# EAGLE design e-wall-smd (EAGLE 6.5.0)
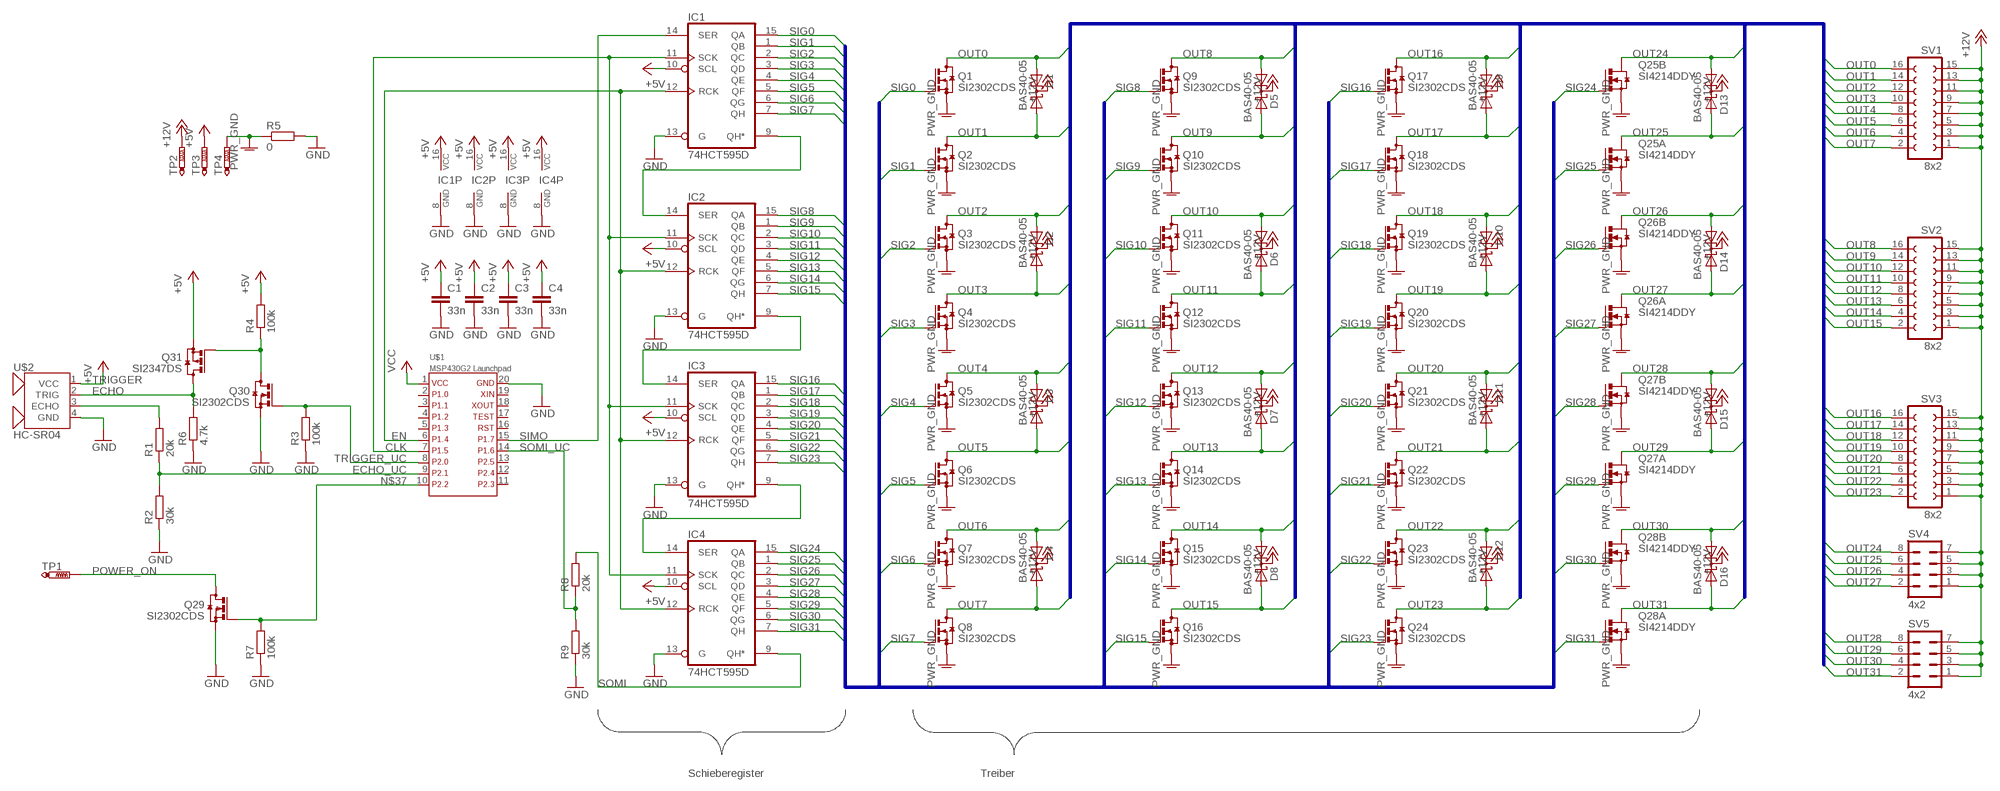
[diagram p0: schematic, sheet 1]

## Parts
C1  33n  C-EUC1206  [C1206]
C2  33n  C-EUC1206  [C1206]
C3  33n  C-EUC1206  [C1206]
C4  33n  C-EUC1206  [C1206]
D1  BAS40-05  [SOT23]
D2  BAS40-05  [SOT23]
D3  BAS40-05  [SOT23]
D4  BAS40-05  [SOT23]
D5  BAS40-05  [SOT23]
D6  BAS40-05  [SOT23]
D7  BAS40-05  [SOT23]
D8  BAS40-05  [SOT23]
D9  BAS40-05  [SOT23]
D10  BAS40-05  [SOT23]
D11  BAS40-05  [SOT23]
D12  BAS40-05  [SOT23]
D13  BAS40-05  [SOT23]
D14  BAS40-05  [SOT23]
D15  BAS40-05  [SOT23]
D16  BAS40-05  [SOT23]
IC1  74HCT595D  [SO16]
IC2  74HCT595D  [SO16]
IC3  74HCT595D  [SO16]
IC4  74HCT595D  [SO16]
Q1  SI2302CDS  BSS123  [SOT23]
Q2  SI2302CDS  BSS123  [SOT23]
Q3  SI2302CDS  BSS123  [SOT23]
Q4  SI2302CDS  BSS123  [SOT23]
Q5  SI2302CDS  BSS123  [SOT23]
Q6  SI2302CDS  BSS123  [SOT23]
Q7  SI2302CDS  BSS123  [SOT23]
Q8  SI2302CDS  BSS123  [SOT23]
Q9  SI2302CDS  BSS123  [SOT23]
Q10  SI2302CDS  BSS123  [SOT23]
Q11  SI2302CDS  BSS123  [SOT23]
Q12  SI2302CDS  BSS123  [SOT23]
Q13  SI2302CDS  BSS123  [SOT23]
Q14  SI2302CDS  BSS123  [SOT23]
Q15  SI2302CDS  BSS123  [SOT23]
Q16  SI2302CDS  BSS123  [SOT23]
Q17  SI2302CDS  BSS123  [SOT23]
Q18  SI2302CDS  BSS123  [SOT23]
Q19  SI2302CDS  BSS123  [SOT23]
Q20  SI2302CDS  BSS123  [SOT23]
Q21  SI2302CDS  BSS123  [SOT23]
Q22  SI2302CDS  BSS123  [SOT23]
Q23  SI2302CDS  BSS123  [SOT23]
Q24  SI2302CDS  BSS123  [SOT23]
Q25  SI4214DDY  IRF8313P  [SO-08]
Q26  SI4214DDY  IRF8313P  [SO-08]
Q27  SI4214DDY  IRF8313P  [SO-08]
Q28  SI4214DDY  IRF8313P  [SO-08]
Q29  SI2302CDS  BSS123  [SOT23]
Q30  SI2302CDS  BSS123  [SOT23]
Q31  SI2347DS  BSS84  [SOT23]
R1  20k  R-EU_R1206  [R1206]
R2  30k  R-EU_R1206  [R1206]
R3  100k  R-EU_R1206  [R1206]
R4  100k  R-EU_R1206  [R1206]
R5  0  R-EU_R1206  [R1206]
R6  4.7k  R-EU_R1206  [R1206]
R7  100k  R-EU_R1206  [R1206]
R8  20k  R-EU_R1206  [R1206]
R9  30k  R-EU_R1206  [R1206]
SV1  8x2  FE08-2  [FE08-2]
SV2  8x2  FE08-2  [FE08-2]
SV3  8x2  FE08-2  [FE08-2]
SV4  4x2  MA04-2  [MA04-2]
SV5  4x2  MA04-2  [MA04-2]
TP1  PTR1PAD1-20  [P1-20]
TP2  PTR1PAD1-20  [P1-20]
TP3  PTR1PAD1-20  [P1-20]
TP4  PTR1PAD1-20  [P1-20]
U$1  MSP430G2 Launchpad  MSP430LAUNCHPAD_BASIC  [MSP430LAUNCHPAD_BASIC]
U$2  HC-SR04  [HC-SR04]

## Nets
+5V [Power]: C1.1 C2.1 C3.1 C4.1 IC1.10(SCL) IC1.16(VCC) IC2.10(SCL) IC2.16(VCC) IC3.10(SCL) IC3.16(VCC) IC4.10(SCL) IC4.16(VCC) Q31.2(S) R4.2 TP3.TP U$2.1(VCC)
+12V [Power]: D1.3(C) D2.3(C) D3.3(C) D4.3(C) D5.3(C) D6.3(C) D7.3(C) D8.3(C) D9.3(C) D10.3(C) D11.3(C) D12.3(C) D13.3(C) D14.3(C) D15.3(C) D16.3(C) SV1.1 SV1.3 SV1.5 SV1.7 SV1.9 SV1.11 SV1.13 SV1.15 SV2.1 SV2.3 SV2.5 SV2.7 SV2.9 SV2.11 SV2.13 SV2.15 SV3.1 SV3.3 SV3.5 SV3.7 SV3.9 SV3.11 SV3.13 SV3.15 SV4.1 SV4.3 SV4.5 SV4.7 SV5.1 SV5.3 SV5.5 SV5.7 TP2.TP
CLK: IC1.11(SCK) IC2.11(SCK) IC3.11(SCK) IC4.11(SCK) U$1.7
ECHO: R1.2 U$2.3(ECHO)
ECHO_UC: R1.1 R2.2 U$1.9
EN: IC1.12(RCK) IC2.12(RCK) IC3.12(RCK) IC4.12(RCK) U$1.6
GND: C1.2 C2.2 C3.2 C4.2 IC1.8(GND) IC1.13(G) IC2.8(GND) IC2.13(G) IC3.8(GND) IC3.13(G) IC4.8(GND) IC4.13(G) Q29.2(S) Q30.2(S) R2.1 R3.1 R5.2 R6.1 R7.1 R9.1 U$1.20 U$2.4(GND)
N$1: IC1.9(QH*) IC2.14(SER)
N$2: IC2.9(QH*) IC3.14(SER)
N$3: IC3.9(QH*) IC4.14(SER)
N$34: Q30.3(D) Q31.1(G) R4.1
N$37: Q29.1(G) R7.2 U$1.10
OUT0: D1.2(A2) Q1.3(D) SV1.16
OUT1: D1.1(A1) Q2.3(D) SV1.14
OUT2: D2.2(A2) Q3.3(D) SV1.12
OUT3: D2.1(A1) Q4.3(D) SV1.10
OUT4: D3.2(A2) Q5.3(D) SV1.8
OUT5: D3.1(A1) Q6.3(D) SV1.6
OUT6: D4.2(A2) Q7.3(D) SV1.4
OUT7: D4.1(A1) Q8.3(D) SV1.2
OUT8: D5.1(A1) Q9.3(D) SV2.16
OUT9: D5.2(A2) Q10.3(D) SV2.14
OUT10: D6.1(A1) Q11.3(D) SV2.12
OUT11: D6.2(A2) Q12.3(D) SV2.10
OUT12: D7.1(A1) Q13.3(D) SV2.8
OUT13: D7.2(A2) Q14.3(D) SV2.6
OUT14: D8.1(A1) Q15.3(D) SV2.4
OUT15: D8.2(A2) Q16.3(D) SV2.2
OUT16: D9.2(A2) Q17.3(D) SV3.16
OUT17: D9.1(A1) Q18.3(D) SV3.14
OUT18: D10.2(A2) Q19.3(D) SV3.12
OUT19: D10.1(A1) Q20.3(D) SV3.10
OUT20: D11.2(A2) Q21.3(D) SV3.8
OUT21: D11.1(A1) Q22.3(D) SV3.6
OUT22: D12.2(A2) Q23.3(D) SV3.4
OUT23: D12.1(A1) Q24.3(D) SV3.2
OUT24: D13.1(A1) Q25.7(B:D) Q25.8(B:D) SV4.8
OUT25: D13.2(A2) Q25.5(A:D) Q25.6(A:D) SV4.6
OUT26: D14.1(A1) Q26.7(B:D) Q26.8(B:D) SV4.4
OUT27: D14.2(A2) Q26.5(A:D) Q26.6(A:D) SV4.2
OUT28: D15.1(A1) Q27.7(B:D) Q27.8(B:D) SV5.8
OUT29: D15.2(A2) Q27.5(A:D) Q27.6(A:D) SV5.6
OUT30: D16.1(A1) Q28.7(B:D) Q28.8(B:D) SV5.4
OUT31: D16.2(A2) Q28.5(A:D) Q28.6(A:D) SV5.2
POWER_ON: Q29.3(D) TP1.TP
PWR_GND: Q1.2(S) Q2.2(S) Q3.2(S) Q4.2(S) Q5.2(S) Q6.2(S) Q7.2(S) Q8.2(S) Q9.2(S) Q10.2(S) Q11.2(S) Q12.2(S) Q13.2(S) Q14.2(S) Q15.2(S) Q16.2(S) Q17.2(S) Q18.2(S) Q19.2(S) Q20.2(S) Q21.2(S) Q22.2(S) Q23.2(S) Q24.2(S) Q25.1(B:S) Q25.3(A:S) Q26.1(B:S) Q26.3(A:S) Q27.1(B:S) Q27.3(A:S) Q28.1(B:S) Q28.3(A:S) R5.1 TP4.TP
SIG0: IC1.15(QA) Q1.1(G)
SIG1: IC1.1(QB) Q2.1(G)
SIG2: IC1.2(QC) Q3.1(G)
SIG3: IC1.3(QD) Q4.1(G)
SIG4: IC1.4(QE) Q5.1(G)
SIG5: IC1.5(QF) Q6.1(G)
SIG6: IC1.6(QG) Q7.1(G)
SIG7: IC1.7(QH) Q8.1(G)
SIG8: IC2.15(QA) Q9.1(G)
SIG9: IC2.1(QB) Q10.1(G)
SIG10: IC2.2(QC) Q11.1(G)
SIG11: IC2.3(QD) Q12.1(G)
SIG12: IC2.4(QE) Q13.1(G)
SIG13: IC2.5(QF) Q14.1(G)
SIG14: IC2.6(QG) Q15.1(G)
SIG15: IC2.7(QH) Q16.1(G)
SIG16: IC3.15(QA) Q17.1(G)
SIG17: IC3.1(QB) Q18.1(G)
SIG18: IC3.2(QC) Q19.1(G)
SIG19: IC3.3(QD) Q20.1(G)
SIG20: IC3.4(QE) Q21.1(G)
SIG21: IC3.5(QF) Q22.1(G)
SIG22: IC3.6(QG) Q23.1(G)
SIG23: IC3.7(QH) Q24.1(G)
SIG24: IC4.15(QA) Q25.2(B:G)
SIG25: IC4.1(QB) Q25.4(A:G)
SIG26: IC4.2(QC) Q26.2(B:G)
SIG27: IC4.3(QD) Q26.4(A:G)
SIG28: IC4.4(QE) Q27.2(B:G)
SIG29: IC4.5(QF) Q27.4(A:G)
SIG30: IC4.6(QG) Q28.2(B:G)
SIG31: IC4.7(QH) Q28.4(A:G)
SIMO: IC1.14(SER) U$1.15
SOMI: IC4.9(QH*) R8.2
SOMI_UC: R8.1 R9.2 U$1.14
TRIGGER: Q31.3(D) R6.2 U$2.2(TRIG)
TRIGGER_UC: Q30.1(G) R3.2 U$1.8
VCC [Power]: U$1.1
Unconnected: U$1.2 U$1.3 U$1.4 U$1.5 U$1.11 U$1.12 U$1.13 U$1.16 U$1.17 U$1.18 U$1.19

## Buses
SIG[0..31]
OUT[0..31]

## Notes on the sheet
- Schieberegister | Treiber

## Library data of the parts
C1-C4 = resistor:C-EU: CAPACITOR, European symbol
D1-D16 = diode:BAS40-05: Silicon Schottky Diodes General-purpose diode for high-speed switching
IC1-IC4 = 74xx-eu:74*595: 8-bit SHIFT REGISTER, output latch
Q1-Q24 Q29 Q30 = transistor-small-signal:BSS123: N-CHANNEL MOS FET
Q25-Q28 = transistor-power:IRF8313P: HEXFET(R) Power MOSFET Source: Data sheet <http://www.irf.com/product-info/datasheets/data/irf8313pbf.pdf>
Q31 = transistor-small-signal:BSS84: P-CHANNEL MOS FET
R1-R9 = resistor:R-EU_: RESISTOR, European symbol
SV1-SV3 = con-lsta:FE08-2: FEMALE HEADER; OC_FARNELL: unknown; OC_NEWARK: unknown
SV4 SV5 = con-lstb:MA04-2: PIN HEADER; OC_FARNELL: unknown; OC_NEWARK: unknown
TP1-TP4 = testpad:PTR1: TEST PIN
U$1 = msp430launchpad:MSP430LAUNCHPAD_BASIC
U$2 = ultrasonic:HC-SR04

## Net classes
0 default: width 0.406 mm, clearance 0.15 mm
1 Power: width 0.61 mm, clearance 0.15 mm to class 0, clearance 0.15 mm

## Board
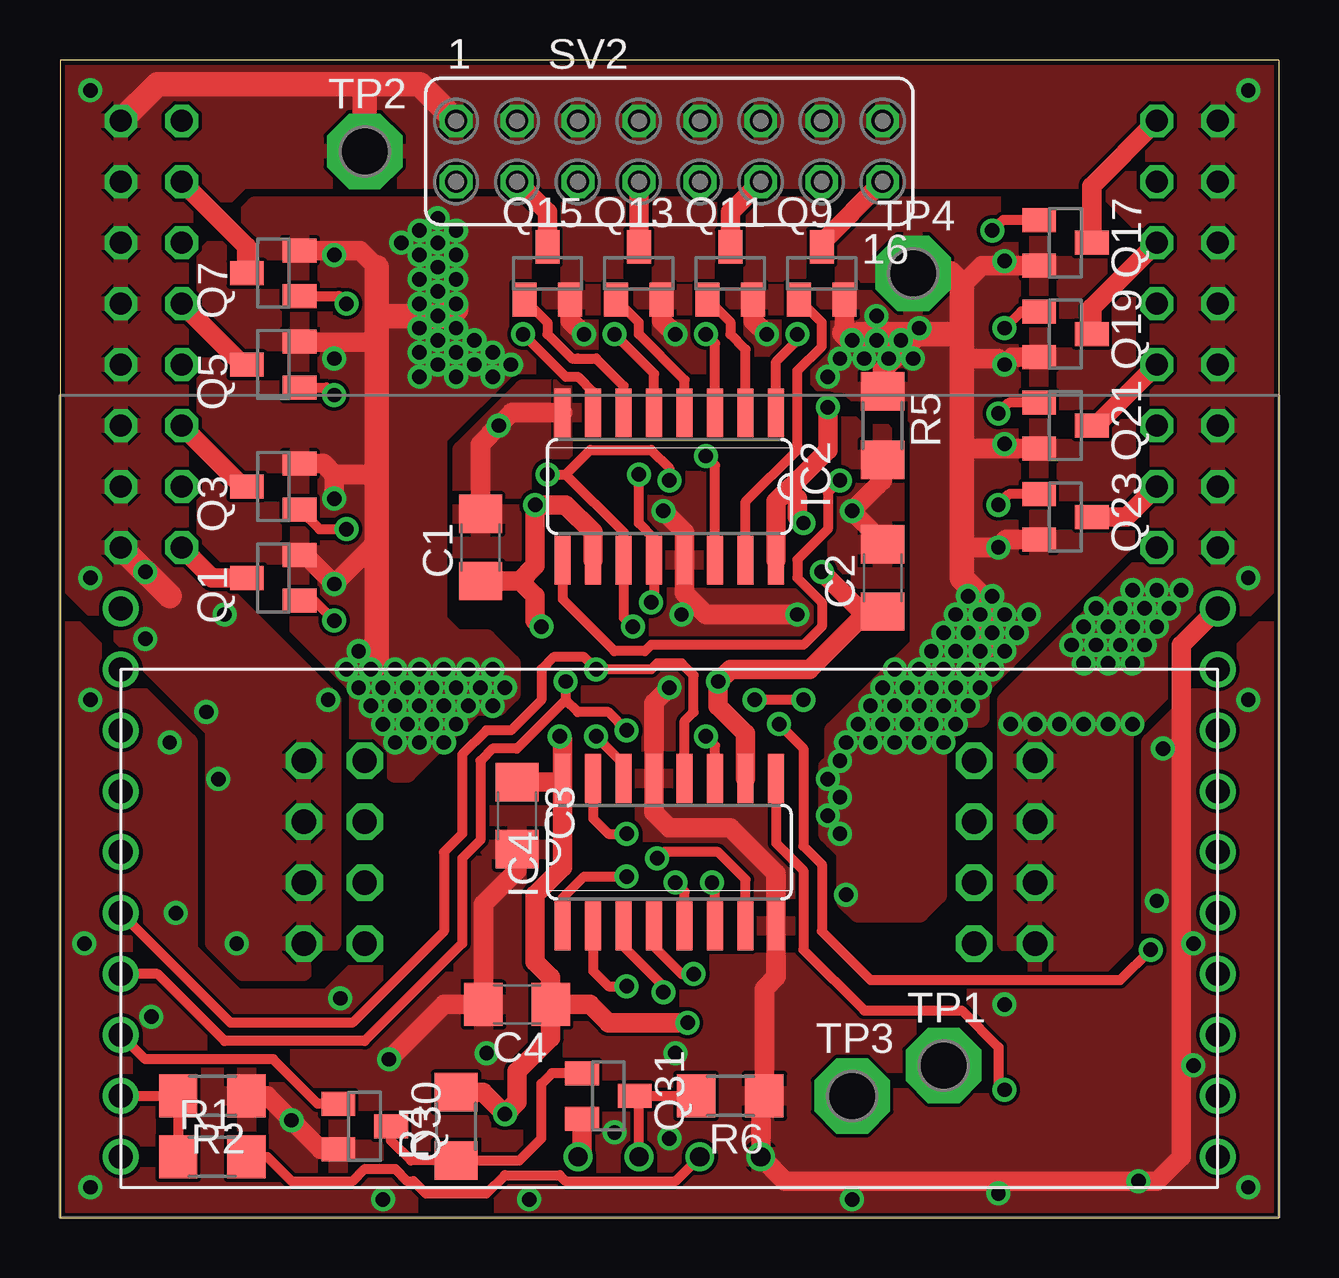
[diagram p1: board, top side]
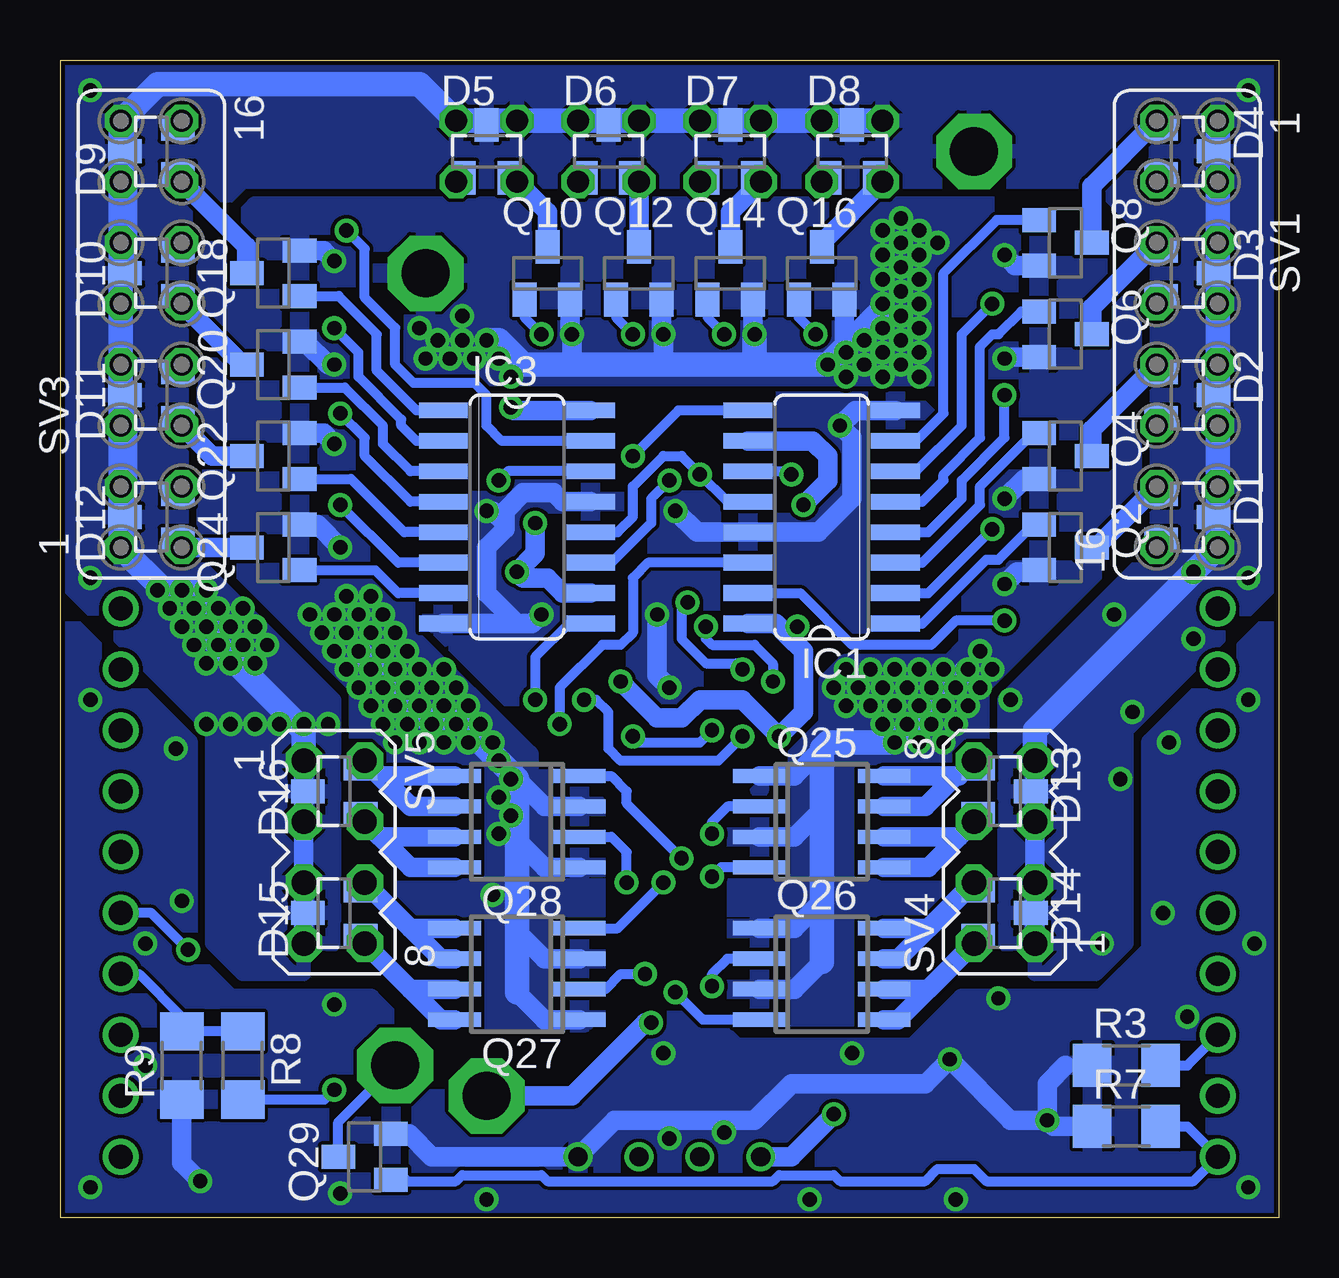
[diagram p2: board, bottom side, seen from below]

Size 50.8 x 48.26 mm. Coordinates in mm from the lower left corner, seen from the top.
Outline: 50.8,48.26 0,48.26 0,0 50.8,0 50.8,48.26
Copper layers (1*16): TOP 0.035mm / dielectric 1.5mm / Bottom 0.035mm
Design rules "platinensammler_03 *": minimum track width 0.15mm, minimum drill 0.3mm, track to track 0.15mm, track to pad 0.15mm, pad to pad 0.15mm, via to via 0.15mm, smd to smd 0mil, copper to edge 0.2mm, drill to drill 0.2mm, minimum pad ring 0.2mm, minimum via ring 0.2mm, stop-mask expansion 2mil, vias tented up to drill 0.8mm, thermal gap 0.15mm

### Footprints (pad centres in the part's own frame; a part is rotated, then mirrored left to right if it is on the bottom)
C1206 = smd 1.6 x 1.8: 1 -1.4,0; 2 1.4,0
SOT23 = smd 1 x 1.4: 1 -0.95,-1.1; 2 0.95,-1.1; 3 0,1.1
SO16 = smd 0.66 x 2.032: 1 -4.445,-3.073; 2 -3.175,-3.073; 3 -1.905,-3.073; 4 -0.635,-3.073; 5 0.635,-3.073; 6 1.905,-3.073; 7 3.175,-3.073; 8 4.445,-3.073; 9 4.445,3.073; 10 3.175,3.073; 11 1.905,3.073; 12 0.635,3.073; 13 -0.635,3.073; 14 -1.905,3.073; 15 -3.175,3.073; 16 -4.445,3.073
SO-08 = smd 0.6 x 2.2: 1 -1.905,-2.6; 2 -0.635,-2.6; 3 0.635,-2.6; 4 1.905,-2.6; 5 1.905,2.6; 6 0.635,2.6; 7 -0.635,2.6; 8 -1.905,2.6
R1206 = smd 1.6 x 1.803: 1 -1.422,0; 2 1.422,0
FE08-2 = drill 0.914 octagon: 1 -8.89,1.27; 2 -8.89,-1.27; 3 -6.35,1.27; 4 -6.35,-1.27; 5 -3.81,1.27; 6 -3.81,-1.27; 7 -1.27,1.27; 8 -1.27,-1.27; 9 1.27,1.27; 10 1.27,-1.27; 11 3.81,1.27; 12 3.81,-1.27; 13 6.35,1.27; 14 6.35,-1.27; 15 8.89,1.27; 16 8.89,-1.27
MA04-2 = drill 1.016 octagon: 1 -3.81,-1.27; 2 -3.81,1.27; 3 -1.27,-1.27; 4 -1.27,1.27; 5 1.27,-1.27; 6 1.27,1.27; 7 3.81,-1.27; 8 3.81,1.27
P1-20 = drill 2.007 pad 3.15 octagon: TP 0,0
MSP430LAUNCHPAD_BASIC = drill 1: 1 -22.86,11.43; 2 -22.86,8.89; 3 -22.86,6.35; 4 -22.86,3.81; 5 -22.86,1.27; 6 -22.86,-1.27; 7 -22.86,-3.81; 8 -22.86,-6.35; 9 -22.86,-8.89; 10 -22.86,-11.43; 11 22.86,-11.43; 12 22.86,-8.89; 13 22.86,-6.35; 14 22.86,-3.81; 15 22.86,-1.27; 16 22.86,1.27; 17 22.86,3.81; 18 22.86,6.35; 19 22.86,8.89; 20 22.86,11.43
HC-SR04 = drill 0.8: 1 -3.81,0; 2 -1.27,0; 3 1.27,0; 4 3.81,0

### Placement (x,y rotation side)
C1  17.53,27.94 90 top
C2  34.29,26.67 90 top
C3  19.05,16.76 270 top
C4  19.05,8.89 180 top
D1  3.81,29.21 270 bottom
D2  3.81,34.29 270 bottom
D3  3.81,39.37 270 bottom
D4  3.81,44.45 270 bottom
D5  33.02,44.45 0 bottom
D6  27.94,44.45 0 bottom
D7  22.86,44.45 0 bottom
D8  17.78,44.45 0 bottom
D9  46.99,44.45 90 bottom
D10  46.99,39.37 90 bottom
D11  46.99,34.29 90 bottom
D12  46.99,29.21 90 bottom
D13  11.43,17.78 270 bottom
D14  11.43,12.7 270 bottom
D15  39.37,12.7 90 bottom
D16  39.37,17.78 90 bottom
IC1  19.05,29.21 90 bottom
IC2  25.4,30.48 180 top
IC3  31.75,29.21 270 bottom
IC4  25.4,15.24 0 top
Q1  8.89,26.67 90 top
Q2  8.89,27.94 270 bottom
Q3  8.89,30.48 90 top
Q4  8.89,31.75 270 bottom
Q5  8.89,35.56 90 top
Q6  8.89,36.83 270 bottom
Q7  8.89,39.37 90 top
Q8  8.89,40.64 270 bottom
Q9  31.75,39.37 0 top
Q10  30.48,39.37 0 bottom
Q11  27.94,39.37 0 top
Q12  26.67,39.37 0 bottom
Q13  24.13,39.37 0 top
Q14  22.86,39.37 0 bottom
Q15  20.32,39.37 0 top
Q16  19.05,39.37 0 bottom
Q17  41.91,40.64 270 top
Q18  41.91,39.37 90 bottom
Q19  41.91,36.83 270 top
Q20  41.91,35.56 90 bottom
Q21  41.91,33.02 270 top
Q22  41.91,31.75 90 bottom
Q23  41.91,29.21 270 top
Q24  41.91,27.94 90 bottom
Q25  19.05,16.51 270 bottom
Q26  19.05,10.16 270 bottom
Q27  31.75,10.16 90 bottom
Q28  31.75,16.51 90 bottom
Q29  38.1,2.54 90 bottom
Q30  12.7,3.81 270 top
Q31  22.86,5.08 270 top
R1  6.35,2.54 0 top
R2  6.35,5.08 180 top
R3  6.35,6.35 0 bottom
R4  16.51,3.81 90 top
R5  34.29,33.02 270 top
R6  27.94,5.08 180 top
R7  6.35,3.81 0 bottom
R8  43.18,6.35 270 bottom
R9  45.72,6.35 90 bottom
SV1  3.81,36.83 270 bottom
SV2  25.4,44.45 0 top
SV3  46.99,36.83 90 bottom
SV4  11.43,15.24 90 bottom
SV5  39.37,15.24 270 bottom
TP1  36.83,6.35 0 top
TP2  12.7,44.45 0 top
TP3  33.02,5.08 0 top
TP4  35.56,39.37 0 top
U$1  25.4,13.97 0 top
U$2  25.4,2.54 0 top

### Tracks (layer width: path | path; a pad name or v marks a point on that pad's centre or on a via)
+5V  (via drill 0.6)
  TOP 0.813: IC2.10 22.23,28.57 21.08,29.72 v19.81,29.72 19.81,27.18 19.17,26.54 | v32,33.78 32,32 30.48,30.48 | IC2.16 29.84,29.84 30.48,30.48 | 30.48,30.48 30.48,30.23 30.73,29.97 30.73,29.21 v30.99,28.96 | 33.53,25.15 31.24,22.86 27.94,22.86 v27.43,22.35 27.43,21.34 28.57,20.19 IC4.10 | v20.07,24.64 19.81,24.89 19.81,25.91 19.18,26.54 19.17,26.54 | Q31.2 21.76,2.71 U$2.1 | R4.2 17.63,5.23 v18.54,4.32 19.05,4.83 19.05,6.1 20.45,7.5 C4.1 | 33.53,25.15 34.17,25.15 C2.1 | v31.75,26.92 33.53,25.15 | v26.16,8.13 22.86,8.13 22.1,8.89 C4.1 | C4.1 20.45,10.03 19.81,10.67 19.81,13.46 20.95,14.61 IC4.16 | v20.83,20.07 20.95,19.94 IC4.16 | C3.1 20.81,18.16 IC4.16 | C1.1 19.17,26.54
  Bottom 0.813: IC1.10 19.43,32.38 18.8,31.75 18.8,30.73 v19.81,29.72 | IC3.16 31.88,33.66 v32,33.78 | v30.99,28.96 30.99,27.69 v31.75,26.92 31.5,26.67 30.48,26.67 29.84,26.04 IC3.10 | v27.43,22.35 25.91,20.83 24.89,20.83 24.13,21.59 22.35,21.59 v20.83,20.07 19.81,21.08 19.81,23.62 20.45,24.26 | IC1.16 20.95,24.77 20.45,24.26 | v20.07,24.64 20.45,24.26 | U$2.1 20.32,2.54 v18.54,4.32 | TP3.TP 29.46,5.08 26.42,8.13 v26.16,8.13
+12V  (via drill 0.6)
  TOP 1.016: 12.7,47.24 4.06,47.24 SV1.1 | 12.7,47.24 14.99,47.24 SV2.1 | TP2.TP 12.7,47.24 | SV1.15 4.57,25.91
  Bottom 0.813: D12.3 48.09,28.11 SV3.1 | SV4.7 10.16,17.95 D13.3 10.16,17.61 SV4.5 SV4.3 10.16,12.87 D14.3 10.16,12.53 SV4.1 | SV5.7 40.64,12.53 D15.3 40.64,12.87 SV5.5 SV5.3 40.64,17.61 D16.3 40.64,17.95 SV5.1
  Bottom 1.016: SV1.1 2.54,44.45 | 2.54,44.45 SV1.3 SV1.5 2.54,39.37 | 2.54,39.37 SV1.7 SV1.9 2.54,34.29 | 2.54,34.29 SV1.11 SV1.13 2.54,29.21 | 2.54,29.21 SV1.15 10.16,20.32 SV4.7 | 48.09,45.89 SV3.15 SV3.13 SV3.11 SV3.9 SV3.7 SV3.5 SV3.3 SV3.1 46.48,26.16 45.21,26.16 44.45,25.4 44.45,24.13 40.64,20.32 SV5.1 | D1.3 2.54,29.21 | D2.3 2.54,34.29 | D3.3 2.54,39.37 | D11.3 D12.3 | D10.3 D9.3 48.09,45.89 | 48.09,45.89 46.74,47.24 35.81,47.24 SV2.15 33.02,45.72 | D4.3 2.54,44.45 | 33.02,45.72 SV2.13 SV2.11 27.94,45.72 | 27.94,45.72 SV2.9 SV2.7 22.86,45.72 | 22.86,45.72 SV2.5 SV2.3 17.78,45.72 | 17.78,45.72 SV2.1 | D8.3 17.78,45.72 | D7.3 22.86,45.72 | D6.3 27.94,45.72 | D5.3 33.02,45.72
  other vias: 1.27,46.99 49.53,46.99 49.53,26.67 1.27,26.67 6.1,21.08 6.6,18.29 6.86,25.15 3.56,24.13 3.56,26.92 40.64,20.57 41.66,20.57 42.67,20.57 43.69,20.57 46.74,26.16 45.72,26.16 44.7,26.16 7.37,11.43 11.18,21.59 44.7,20.57 39.62,20.57 45.21,25.4 44.2,25.4 46.23,25.4 45.72,24.64 44.7,24.64 43.69,24.64 43.18,25.4 42.67,24.64 45.21,23.88 44.2,23.88 43.18,23.88 42.16,23.88 42.67,23.11 43.69,23.11 44.7,23.11
  pour TOP: 6.35,11.43 7.62,10.16 10.16,10.16 11.43,11.43 11.43,21.59 5.08,27.94 5.08,40.64 7.62,43.18 43.18,43.18 45.72,40.64 45.72,27.94 39.37,21.59 39.37,11.43 40.64,10.16 43.18,10.16 44.45,11.43 44.45,20.32 50.8,26.67 50.8,48.26 0,48.26 0,26.67 6.35,20.32
  pour Bottom: 6.35,11.43 7.62,10.16 10.16,10.16 11.43,11.43 11.43,21.59 5.08,27.94 5.08,40.64 7.62,43.18 43.18,43.18 45.72,40.64 45.72,27.94 39.37,21.59 39.37,11.43 40.64,10.16 43.18,10.16 44.45,11.43 44.45,20.32 50.8,26.67 50.8,48.26 0,48.26 0,26.67 6.35,20.32
CLK  (via drill 0.6)
  TOP 0.406: 21.08,30.99 23.5,28.57 IC2.11 23.5,25.02 v23.88,24.64 | v20.32,30.99 21.08,30.99 | 21.08,30.99 22.1,32 24.64,32 25.4,31.24 v25.4,30.73 | IC4.11 27.3,19.68 v26.92,20.07 | v23.62,20.32 22.86,21.08 21.59,21.08 21.08,21.59 | U$1.7 4.06,10.16 6.86,7.37 12.7,7.37 16.76,11.43 16.76,14.99 17.53,15.75 17.53,19.05 18.03,19.56 19.05,19.56 21.08,21.59 | v21.08,22.35 21.08,21.59
  Bottom 0.406: IC1.11 20.45,31.11 v20.32,30.99 | v25.4,30.73 26.16,29.97 26.16,28.96 27.81,27.3 IC3.11 | v23.88,24.64 23.88,24.13 23.62,23.88 21.84,23.88 21.08,23.11 v21.08,22.35 | v26.92,20.07 26.67,19.81 24.13,19.81 v23.62,20.32
ECHO
  TOP 0.406: R1.2 8.64,2.54 9.65,1.52 12.19,1.52 12.7,2.03 13.97,2.03 14.48,1.52 14.73,1.52 15.24,1.02 17.78,1.02 18.54,1.78 20.83,1.78 21.08,1.52 25.65,1.52 U$2.3
ECHO_UC
  TOP 0.406: U$1.9 R2.2 R1.1
EN  (via drill 0.6)
  TOP 0.406: v24.13,30.99 24.13,28.96 24.77,28.32 IC2.12 24.77,25.78 v24.64,25.65 | IC4.12 26.04,20.7 26.42,21.08 26.42,22.61 25.91,23.11 24.89,23.11 24.64,22.86 v22.35,22.86 21.84,23.37 20.57,23.37 20.07,22.86 20.07,21.59 18.8,20.32 17.78,20.32 16.76,19.3 16.76,16 16,15.24 16,11.94 12.19,8.13 7.11,8.13 U$1.6
  Bottom 0.406: IC3.12 27.56,28.57 26.92,29.21 26.92,30.48 25.65,31.75 24.89,31.75 v24.13,30.99 22.99,29.84 IC1.12 | v24.64,25.65 24.89,25.4 24.89,24.13 23.88,23.11 22.61,23.11 v22.35,22.86
GND  (via drill 0.6)
  TOP 0.813: 29.21,4.93 U$2.4 30.23,1.52 v44.96,1.52 45.72,1.52 46.74,2.54 46.74,23.88 U$1.20 | 8.64,5.08 v9.65,4.06 10.86,2.86 | v13.72,6.6 16,8.89 C4.2 17.65,13.08 19.05,14.48 C3.2 | 26.42,25.65 26.04,26.04 IC2.13 26.04,28.57 v25.15,29.46 | v30.73,25.15 26.92,25.15 26.42,25.65 | C1.2 17.53,32.26 v18.29,33.02 18.82,33.55 IC2.8 | C2.2 34.29,28.19 v33.02,29.46 34.29,30.73 R5.2 | R6.1 29.36,9.55 29.84,10.03 IC4.8 29.84,14.35 27.94,16.26 25.4,16.26 24.77,16.89 IC4.13 24.77,21.46 v25.4,22.1 | 26.42,25.65 v25.91,25.15
  Bottom 0.813: v9.65,4.06 11.18,4.06 v13.72,6.6 14.73,5.59 20.32,5.59 21.84,4.06 27.69,4.06 U$2.4 35.31,2.54 36.26,3.49 | 8.89,6.35 9.65,5.59 v9.65,4.06 | 45.72,5.08 R9.1 45.72,2.29 v44.96,1.52 | v30.73,25.15 31.11,24.77 31.75,24.77 | R7.1 9.4,3.81 v9.65,4.06 | 31.75,24.77 IC3.8 | IC1.8 17.65,33.66 v18.29,33.02 17.78,32.51 17.78,29.97 19.18,28.57 IC1.13 24.26,28.57 v25.15,29.46 | IC3.13 29.84,29.84 30.23,30.23 31.5,30.23 32.26,29.46 32.26,28.96 | 32.26,28.96 32.26,28.7 33.02,27.94 33.02,26.04 31.75,24.77 | v33.02,29.46 32.77,29.46 32.26,28.96 | v25.91,25.15 25.91,22.61 v25.4,22.1
  other vias: 1.27,1.27 1.27,21.59 17.78,6.86 25.65,6.86 49.53,1.27 49.53,21.59 4.57,19.81 3.81,8.38 11.68,9.14 33.02,0.76 39.12,1.02 19.56,0.76 13.46,0.76 25.4,3.3 23.11,3.56 45.97,19.56 45.72,13.21 39.37,8.89 47.24,11.43 47.24,6.35 4.83,12.7 1.02,11.43
  pour Bottom: 0.51,24.64 0.51,0.51 50.29,0.51 50.29,24.64 45.47,19.81 45.47,10.92 43.69,9.14 37.85,9.14 35.56,6.86 27.94,6.86 26.92,7.87 26.92,17.27 29.21,19.56 29.97,19.56 35.31,24.89 35.31,33.53 34.8,34.04 15.24,34.04 13.97,32.77 13.97,24.89 14.73,24.13 18.8,24.13 19.81,23.11 19.81,21.34 23.62,17.53 23.62,8.13 22.61,7.11 15.24,7.11 13.21,9.14 7.37,9.14 5.33,11.18 5.33,19.81
  pour TOP: 0.51,24.64 0.51,0.51 50.29,0.51 50.29,24.64 45.47,19.81 45.47,10.92 43.69,9.14 39.88,9.14 37.85,11.18 32,11.18 30.99,12.19 30.99,20.83 34.8,24.64 34.8,32.26 34.29,32.77 33.27,32.77 32.26,33.78 31.24,33.78 30.48,34.54 19.3,34.54 16.76,32 16.76,25.91 17.27,25.4 18.03,25.4 20.07,23.37 20.07,21.34 18.8,20.07 18.03,20.07 15.49,17.53 12.95,17.53 12.45,17.02 12.45,10.41 11.18,9.14 7.37,9.14 5.33,11.18 5.33,19.81
N$1  (via drill 0.6)
  TOP 0.406: v26.92,31.75 27.3,31.37 IC2.14
  Bottom 0.406: IC1.9 25.02,33.66 v26.92,31.75
N$2  (via drill 0.6)
  TOP 0.406: v32.51,30.73 32,30.23 32,28.7 30.73,27.43 30.73,26.67 31.75,25.65 31.75,24.64 30.99,23.88 24.64,23.88 24.38,23.62 23.11,23.62 20.95,25.78 IC2.9
  Bottom 0.406: IC3.14 32.13,31.11 v32.51,30.73
N$3  (via drill 0.6)
  TOP 0.406: v30.99,21.59 v28.96,21.59 | IC4.14 23.5,18.92 v22.35,20.07
  Bottom 0.406: IC3.9 29.59,24.77 30.99,23.37 v30.99,21.59 | v22.35,20.07 23.37,19.05 27.43,19.05 27.94,19.56 27.94,21.08 28.45,21.59 v28.96,21.59
N$34
  TOP 0.406: Q30.3 13.8,3.22 14.63,2.39 R4.1 19.15,2.39 20.07,3.3 20.07,5.59 20.51,6.03 Q31.1
N$37
  Bottom 0.406: R7.2 3.81,3.81 U$1.10 3.56,1.52 12.19,1.52 12.7,2.03 14.22,2.03 14.73,1.52 18.29,1.52 18.54,1.78 20.83,1.78 21.08,1.52 30.48,1.52 30.73,1.78 34.04,1.78 34.29,1.52 36.32,1.52 36.39,1.59 Q29.1
OUT0
  TOP 0.813: Q1.3 6.35,26.67 SV1.16
  Bottom 0.813: D1.2 4.91,28.11 SV1.16
OUT1
  Bottom 0.813: D1.1 4.91,30.31 SV1.14 7.62,27.94 Q2.3
OUT2
  TOP 0.813: Q3.3 7.62,30.48 SV1.12
  Bottom 0.813: SV1.12 5.08,33.17 D2.2
OUT3
  Bottom 0.813: D2.1 4.91,35.39 SV1.10 7.79,32.85 Q4.3
OUT4
  TOP 0.813: Q5.3 7.62,35.56 SV1.8
  Bottom 0.813: D3.2 4.91,38.27 SV1.8
OUT5
  Bottom 0.813: D3.1 5.08,40.49 SV1.6 7.79,37.93 Q6.3
OUT6
  TOP 0.813: Q7.3 7.79,40.47 SV1.4
  Bottom 0.813: SV1.4 5.08,43.33 D4.2
OUT7
  Bottom 0.813: D4.1 4.91,45.55 SV1.2 7.79,43.01 Q8.3
OUT8
  TOP 0.813: Q9.3 31.75,40.64 SV2.16
  Bottom 0.813: D5.1 34.12,43.35 SV2.16
OUT9
  Bottom 0.813: Q10.3 30.48,41.91 SV2.14 31.92,43.35 D5.2
OUT10
  TOP 0.813: Q11.3 27.94,41.91 SV2.12
  Bottom 0.813: D6.1 29.04,43.35 SV2.12
OUT11
  Bottom 0.813: Q12.3 SV2.10 26.84,43.35 D6.2
OUT12
  TOP 0.813: Q13.3 SV2.8
  Bottom 0.813: D7.1 23.96,43.35 SV2.8
OUT13
  Bottom 0.813: Q14.3 22.86,41.91 SV2.6 21.76,43.35 D7.2
OUT14
  TOP 0.813: Q15.3 20.32,41.91 SV2.4
  Bottom 0.813: D8.1 18.88,43.35 SV2.4
OUT15
  Bottom 0.813: Q16.3 19.05,40.64 SV2.2 16.68,43.35 D8.2
OUT16
  TOP 0.813: Q17.3 43.01,43.01 SV3.16
  Bottom 0.813: D9.2 45.89,45.55 SV3.16
OUT17
  Bottom 0.813: D9.1 45.72,43.33 SV3.14 43.01,40.47 Q18.3
OUT18
  TOP 0.813: Q19.3 43.01,37.93 SV3.12
  Bottom 0.813: D10.2 45.89,40.47 SV3.12
OUT19
  Bottom 0.813: D10.1 45.72,38.25 SV3.10 43.18,35.56 Q20.3
OUT20
  TOP 0.813: Q21.3 43.18,33.02 SV3.8
  Bottom 0.813: D11.2 45.89,35.39 SV3.8
OUT21
  Bottom 0.813: D11.1 45.72,33.17 SV3.6 44.45,31.75 Q22.3
OUT22
  TOP 0.813: Q23.3 44.45,29.21 SV3.4
  Bottom 0.813: D12.2 45.89,30.31 SV3.4
OUT23
  Bottom 0.813: Q24.3 SV3.2 45.72,28.09 D12.1
OUT24
  Bottom 0.813: Q25.8 13.46,18.41 | 13.46,18.41 13.34,18.41 SV4.8 12.7,18.9 D13.1 | Q25.7 14.73,17.14 13.46,18.41
OUT25
  Bottom 0.813: Q25.6 13.34,15.88 | 13.34,15.88 SV4.6 12.7,16.66 D13.2 | Q25.5 14.61,14.61 13.34,15.88
OUT26
  Bottom 0.813: Q26.8 14.61,12.06 | 14.61,12.06 SV4.4 12.7,13.82 D14.1 | Q26.7 15.88,10.79 14.61,12.06
OUT27
  Bottom 0.813: Q26.6 14.61,9.53 | 14.61,9.53 SV4.2 12.7,11.58 D14.2 | Q26.5 15.88,8.26 14.61,9.53
OUT28
  Bottom 0.813: Q27.7 36.2,9.53 | 36.2,9.53 SV5.8 38.1,11.58 D15.1 | Q27.8 34.92,8.26 36.2,9.53
OUT29
  Bottom 0.813: Q27.5 36.2,12.06 | 36.2,12.06 SV5.6 38.1,13.82 D15.2 | Q27.6 34.92,10.79 36.2,12.06
OUT30
  Bottom 0.813: Q28.7 37.47,15.88 | 37.47,15.88 SV5.4 38.1,16.66 D16.1 | Q28.8 36.2,14.61 37.47,15.88
OUT31
  Bottom 0.813: Q28.5 37.47,18.41 SV5.2 | Q28.6 36.2,17.14 SV5.2 | D16.2 38.1,18.9 SV5.2
POWER_ON
  Bottom 0.406: Q29.3 39.2,3.98 TP1.TP
PWR_GND  (via drill 0.6)
  TOP 0.813: 13.21,39.62 12.51,40.32 11.43,40.32 | Q7.2 11.43,40.32 | 37.59,38.86 38.42,39.69 39.37,39.69 | Q17.2 39.37,39.69 | Q5.2 11.43,36.51 | 11.43,36.51 13.14,36.51 13.21,36.58 | 37.59,35.81 37.66,35.88 37.72,35.81 39.12,35.81 v39.37,35.56 39.69,35.88 Q19.2 | Q21.2 39.37,32.07 | 39.37,32.07 37.66,32.07 37.59,32 | v11.43,40.13 11.43,40.32 | v11.43,35.81 11.43,36.51 | v39.37,39.88 39.37,39.69 | v39.37,32.26 39.37,32.07 | Q13.2 25.08,37.4 v25.65,36.83 | Q15.2 21.27,37.4 v21.84,36.83 | Q11.2 28.89,37.4 v29.46,36.83 | Q9.2 32.7,36.9 | Q23.2 39.44,28.26 v39.12,27.94 37.59,27.94 | 13.21,28.19 v11.43,26.42 10.23,27.62 Q1.2 | Q3.2 10.99,31.43 11.43,30.99 | 11.43,30.99 v11.43,29.97 | 11.43,30.99 13.21,30.99 | R5.1 34.29,35.31 35.81,36.83
  TOP 1.016: 13.21,37.59 13.21,36.58 13.21,30.99 13.21,28.19 13.21,23.11 v12.95,22.86 | 13.21,37.59 13.21,39.62 | 37.59,36.83 37.59,35.81 37.59,32 37.59,27.94 37.59,26.67 38.61,25.65 38.61,23.88 v38.35,23.62 | 37.59,36.83 37.59,38.86 37.08,39.37 TP4.TP | 32.7,36.9 v33.02,36.58 33.27,36.83 35.81,36.83 37.59,36.83 | 13.21,37.59 16,37.59 v16.51,38.1 16.51,37.85
  Bottom 0.813: Q8.2 10.99,39.69 v11.43,40.13 | Q18.2 39.81,40.32 v39.37,39.88 | Q22.2 39.81,32.7 v39.37,32.26 | 25.65,35.56 v25.65,36.83 25.72,36.9 Q12.2 | Q14.2 21.91,36.9 v21.84,36.83 | Q16.2 18.1,36.26 18.16,36.2 | 29.46,35.56 v29.46,36.83 29.53,36.9 Q10.2 | Q24.2 40.07,28.89 v39.12,27.94 | Q6.2 11.36,35.88 v11.43,35.81 | Q2.2 10.06,26.92 10.92,26.92 v11.43,26.42 | Q4.2 10.6,30.8 v11.43,29.97 | Q27.1 30.61,8.26 31.75,9.4 | Q27.3 30.61,10.79 31.75,11.94 | Q28.1 30.61,14.61 31.75,15.75 | Q28.3 30.61,17.14 31.75,18.29 | Q26.3 20.19,9.53 19.05,10.67 | Q25.1 20.19,18.41 19.05,19.56 | Q25.3 20.19,15.88 19.05,17.02 | Q26.1 20.19,12.06 19.05,13.21 | Q20.2 40.57,36.51 39.62,35.56 v39.37,35.56
  Bottom 1.016: v21.84,36.83 21.84,35.56 | 18.16,36.2 v18.8,35.56 21.84,35.56 | 21.84,35.56 25.65,35.56 29.46,35.56 31.5,35.56 32.51,36.58 v33.02,36.58 | 18.1,36.26 16.51,37.85 v16.51,38.1 | 31.75,9.4 31.75,11.94 31.75,15.75 31.75,18.29 34.29,20.83 35.56,20.83 v38.35,23.62 | v12.95,22.86 v16,19.81 18.8,19.81 19.05,19.56 19.05,17.02 19.05,13.21 19.05,10.67
  other vias: 36.32,20.57 35.31,20.57 34.29,20.57 33.27,20.57 37.85,22.86 36.83,22.86 35.81,22.86 18.03,22.86 17.02,22.86 16,22.86 14.99,22.86 13.97,22.86 17.27,36.58 18.03,36.07 32,35.05 32.51,35.81 37.34,22.1 36.32,22.1 35.31,22.1 36.83,21.34 35.81,21.34 34.8,21.34 33.78,21.34 37.34,20.57 36.83,19.81 35.81,19.81 34.8,19.81 33.78,19.81 32.77,19.81 14.48,22.1 15.49,22.1 13.46,22.1 12.45,22.1 13.97,21.34 12.95,21.34 13.46,20.57 14.99,21.34 16,21.34 16.51,22.1 17.53,22.1 17.02,21.34 18.03,21.34 16.51,20.57 15.49,20.57 14.48,20.57 14.99,19.81 13.97,19.81 37.85,21.34 34.29,22.1 37.34,23.62 36.32,23.62 34.8,22.86 17.27,35.56 18.03,35.05 16.51,36.07 16.51,37.08 33.53,35.81 34.04,36.58 35.05,36.58 34.54,35.81 35.56,35.81 16.51,35.05 15.75,35.56 15.75,36.58 15.75,37.59 14.99,36.07 14.99,37.08 14.99,38.1 15.75,38.61 14.99,35.05 14.99,39.12 15.75,39.62 16.51,39.12 16.51,40.13 11.94,22.86 12.45,23.62 18.54,22.1 38.35,22.1 38.86,22.86 39.37,23.62 39.88,24.38 40.39,25.15 38.86,24.38 37.85,24.38 39.37,25.15 36.83,24.38 38.35,25.15 37.34,25.15 37.85,25.91 38.86,25.91 14.99,40.13 15.75,40.64 16.51,41.15 14.99,41.15 14.22,40.64 15.75,41.66 34.04,37.59 35.81,37.08 32.51,19.05 32,18.29 32.51,17.53 32,16.76 32.51,16 32.77,13.46
  pour TOP: 42.67,42.16 8.13,42.16 6.1,40.13 6.1,28.45 12.45,22.1 12.45,20.07 13.97,18.54 14.48,18.54 17.27,21.34 18.29,21.34 18.8,21.84 18.8,23.11 17.78,24.13 16.51,24.13 15.75,24.89 15.75,32.51 18.8,35.56 30.99,35.56 31.75,34.8 32.77,34.8 33.53,34.04 35.05,34.04 35.81,33.27 35.81,23.88 32.26,20.32 32.26,19.05 32,18.8 32,16 32.26,15.75 32.26,15.75 32.77,15.24 32.77,13.21 33.27,12.7 35.81,12.7 36.58,13.46 36.58,19.81 37.59,20.83 38.35,20.83 38.35,22.1 44.45,28.19 44.45,40.39
  pour Bottom: 42.67,42.16 8.13,42.16 6.1,40.13 6.1,28.45 12.45,22.1 12.45,11.43 15.49,8.38 22.35,8.38 22.61,8.64 22.61,16.76 18.8,20.57 18.8,22.35 18.03,23.11 13.72,23.11 12.95,23.88 12.95,33.27 14.73,35.05 35.81,35.05 36.32,34.54 36.32,24.38 31.24,19.3 31.24,18.29 29.46,18.29 28.45,17.27 28.45,8.64 28.96,8.13 35.05,8.13 38.35,11.43 38.35,22.1 44.7,28.45 44.7,40.13
SIG0  (via drill 0.6)
  TOP 0.406: Q1.1 10.6,25.72 v11.43,24.89
  Bottom 0.406: v11.43,24.89 13.46,24.89 14.48,23.88 17.78,23.88 19.94,26.04 IC1.15
SIG1
  Bottom 0.406: IC1.1 14.86,24.77 12.19,27.43 11.68,27.43 10.23,28.89 Q2.1
SIG2  (via drill 0.6)
  TOP 0.406: Q3.1 10.82,28.7 v11.94,28.7
  Bottom 0.406: IC1.2 14.61,26.04 v11.94,28.7
SIG3
  Bottom 0.406: IC1.3 14.86,27.3 12.45,29.72 12.45,30.48 10.23,32.7 Q4.1
SIG4  (via drill 0.6)
  TOP 0.406: Q5.1 11.11,34.61 v11.43,34.29
  Bottom 0.406: IC1.4 14.61,28.57 13.21,29.97 13.21,30.73 11.43,32.51 v11.43,34.29
SIG5
  Bottom 0.406: IC1.5 14.86,29.84 13.97,30.73 13.97,30.99 12.45,32.51 12.45,36.32 11.94,36.83 11.68,36.83 10.73,37.78 Q6.1
SIG6  (via drill 0.6)
  TOP 0.406: Q7.1 11.62,38.42 v11.94,38.1
  Bottom 0.406: 11.94,37.85 v11.94,38.1 13.21,36.83 13.21,33.02 15.11,31.11 IC1.6
SIG7
  Bottom 0.406: Q8.1 11.75,41.59 13.97,39.37 13.97,33.53 15.11,32.38 IC1.7
SIG8
  TOP 0.406: IC2.15 28.57,29.84 30.73,32 30.73,35.31 31.75,36.32 31.75,37.32 Q9.1
SIG9  (via drill 0.6)
  TOP 0.406: v30.73,36.83 30.73,36.58 29.84,35.69 IC2.1
  Bottom 0.406: Q10.1 31.43,37.53 v30.73,36.83
SIG10
  TOP 0.406: IC2.2 28.57,36.2 27.94,36.83 27.94,37.34 27.01,38.27 Q11.1
SIG11  (via drill 0.6)
  TOP 0.406: 27.18,36.58 v26.92,36.83 27.3,36.45 IC2.3
  Bottom 0.406: Q12.1 27.62,37.53 v26.92,36.83
SIG12
  TOP 0.406: Q13.1 24.13,37.32 24.13,36.83 26.04,34.92 IC2.4
SIG13  (via drill 0.6)
  TOP 0.406: v23.11,36.83 24.77,35.18 IC2.5
  Bottom 0.406: Q14.1 23.81,37.53 v23.11,36.83
SIG14
  TOP 0.406: IC2.6 23.5,34.67 22.35,35.81 21.59,35.81 21.34,35.81 20.32,36.83 20.32,37.32 Q15.1
SIG15  (via drill 0.6)
  TOP 0.406: v19.3,36.83 21.08,35.05 21.59,35.05 22.23,34.42 IC2.7
  Bottom 0.406: Q16.1 20,37.53 v19.3,36.83
SIG16  (via drill 0.6)
  TOP 0.406: Q17.1 39.3,41.59 v38.86,41.15
  Bottom 0.406: IC3.15 32.38,32.38 33.02,33.02 33.02,34.29 33.53,34.8 36.07,34.8 36.83,35.56 36.83,37.08 38.1,38.35 38.1,40.39 v38.86,41.15
SIG17
  Bottom 0.406: Q18.1 39.18,38.42 37.59,36.83 37.59,35.31 35.94,33.66 IC3.1
SIG18  (via drill 0.6)
  TOP 0.406: Q19.1 40.07,37.78 v39.37,37.08
  Bottom 0.406: v39.37,37.08 38.35,36.07 38.35,35.05 36.58,33.27 36.58,33.02 35.94,32.38 IC3.2
SIG19
  Bottom 0.406: Q20.1 38.93,34.61 37.34,33.02 37.34,32.26 36.2,31.11 IC3.3
SIG20  (via drill 0.6)
  TOP 0.406: Q21.1 39.56,33.97 v39.12,33.53
  Bottom 0.406: v39.12,33.53 38.1,32.51 38.1,31.75 36.2,29.84 IC3.4
SIG21
  Bottom 0.406: Q22.1 38.67,30.8 36.45,28.57 IC3.5
SIG22  (via drill 0.6)
  TOP 0.406: Q23.1 39.56,30.16 v39.12,29.72
  Bottom 0.406: IC3.6 36.7,27.3 v39.12,29.72
SIG23
  Bottom 0.406: IC3.7 36.7,26.04 37.66,26.99 Q24.1
SIG24  (via drill 0.6)
  TOP 0.406: IC4.15 22.23,16.64 22.86,16 v23.62,16
  Bottom 0.406: v23.62,16 23.62,16.51 22.99,17.14 Q25.2
SIG25  (via drill 0.6)
  TOP 0.406: IC4.1 20.95,13.34 21.84,14.22 v23.62,14.22
  Bottom 0.406: 23.37,14.48 v23.62,14.22 23.24,14.61 Q25.4
SIG26  (via drill 0.6)
  TOP 0.406: IC4.2 22.23,10.29 22.86,9.65 v23.62,9.65
  Bottom 0.406: v23.62,9.65 23.62,10.16 22.99,10.79 Q26.2
SIG27  (via drill 0.6)
  TOP 0.406: IC4.3 23.5,11.3 25.15,9.65 v25.15,9.4
  Bottom 0.406: Q26.4 24,8.26 v25.15,9.4
SIG28  (via drill 0.6)
  TOP 0.406: IC4.4 24.77,11.3 25.91,10.16 v26.42,10.16
  Bottom 0.406: Q27.2 28.07,9.53 27.43,10.16 v26.42,10.16
SIG29  (via drill 0.6)
  TOP 0.406: IC4.5 26.04,13.59 v25.65,13.97
  Bottom 0.406: v25.65,13.97 27.56,12.06 Q27.4
SIG30  (via drill 0.6)
  TOP 0.406: IC4.6 27.3,13.84 v27.18,13.97
  Bottom 0.406: v27.18,13.97 27.18,15.24 27.81,15.88 Q28.2
SIG31  (via drill 0.6)
  TOP 0.406: IC4.7 28.57,14.1 27.43,15.24 25.15,15.24 v24.89,14.99
  Bottom 0.406: v24.89,14.99 27.18,17.27 27.18,17.78 27.81,18.41 Q28.4
SIMO  (via drill 0.6)
  TOP 0.406: v29.97,20.57 30.99,19.56 30.99,15.49 31.75,14.73 31.75,11.94 33.78,9.91 44.2,9.91 v45.47,11.18
  Bottom 0.406: IC1.14 26.29,27.3 26.92,26.67 26.92,24.38 27.43,23.88 28.19,23.88 29.97,22.1 v29.97,20.57 | U$1.15 46.99,12.7 v45.47,11.18
SOMI  (via drill 0.6)
  TOP 0.406: IC4.9 29.84,15.62 30.99,14.48 30.99,11.18 33.53,8.64 37.59,8.64 39.12,7.11 39.12,5.59 v39.37,5.33
  Bottom 0.406: R8.2 39.78,4.93 v39.37,5.33
SOMI_UC
  Bottom 0.406: U$1.14 47.5,10.16 45.72,8.38 R9.2 R8.1
TRIGGER
  TOP 0.406: U$2.2 24.13,4.91 Q31.3 R6.2
TRIGGER_UC
  TOP 0.406: Q30.1 10.73,4.76 8.89,6.6 3.56,6.6 U$1.8
  Bottom 0.406: R3.2 3.81,6.35 U$1.8

### Text on the board
200bmp: 12V | GND | EN | 5V | /home/daniw/Downloads/oshw-logo-800-px.bmp